# EAGLE design PixelRing (EAGLE 8.4.0)

## Sheet 1 of 2
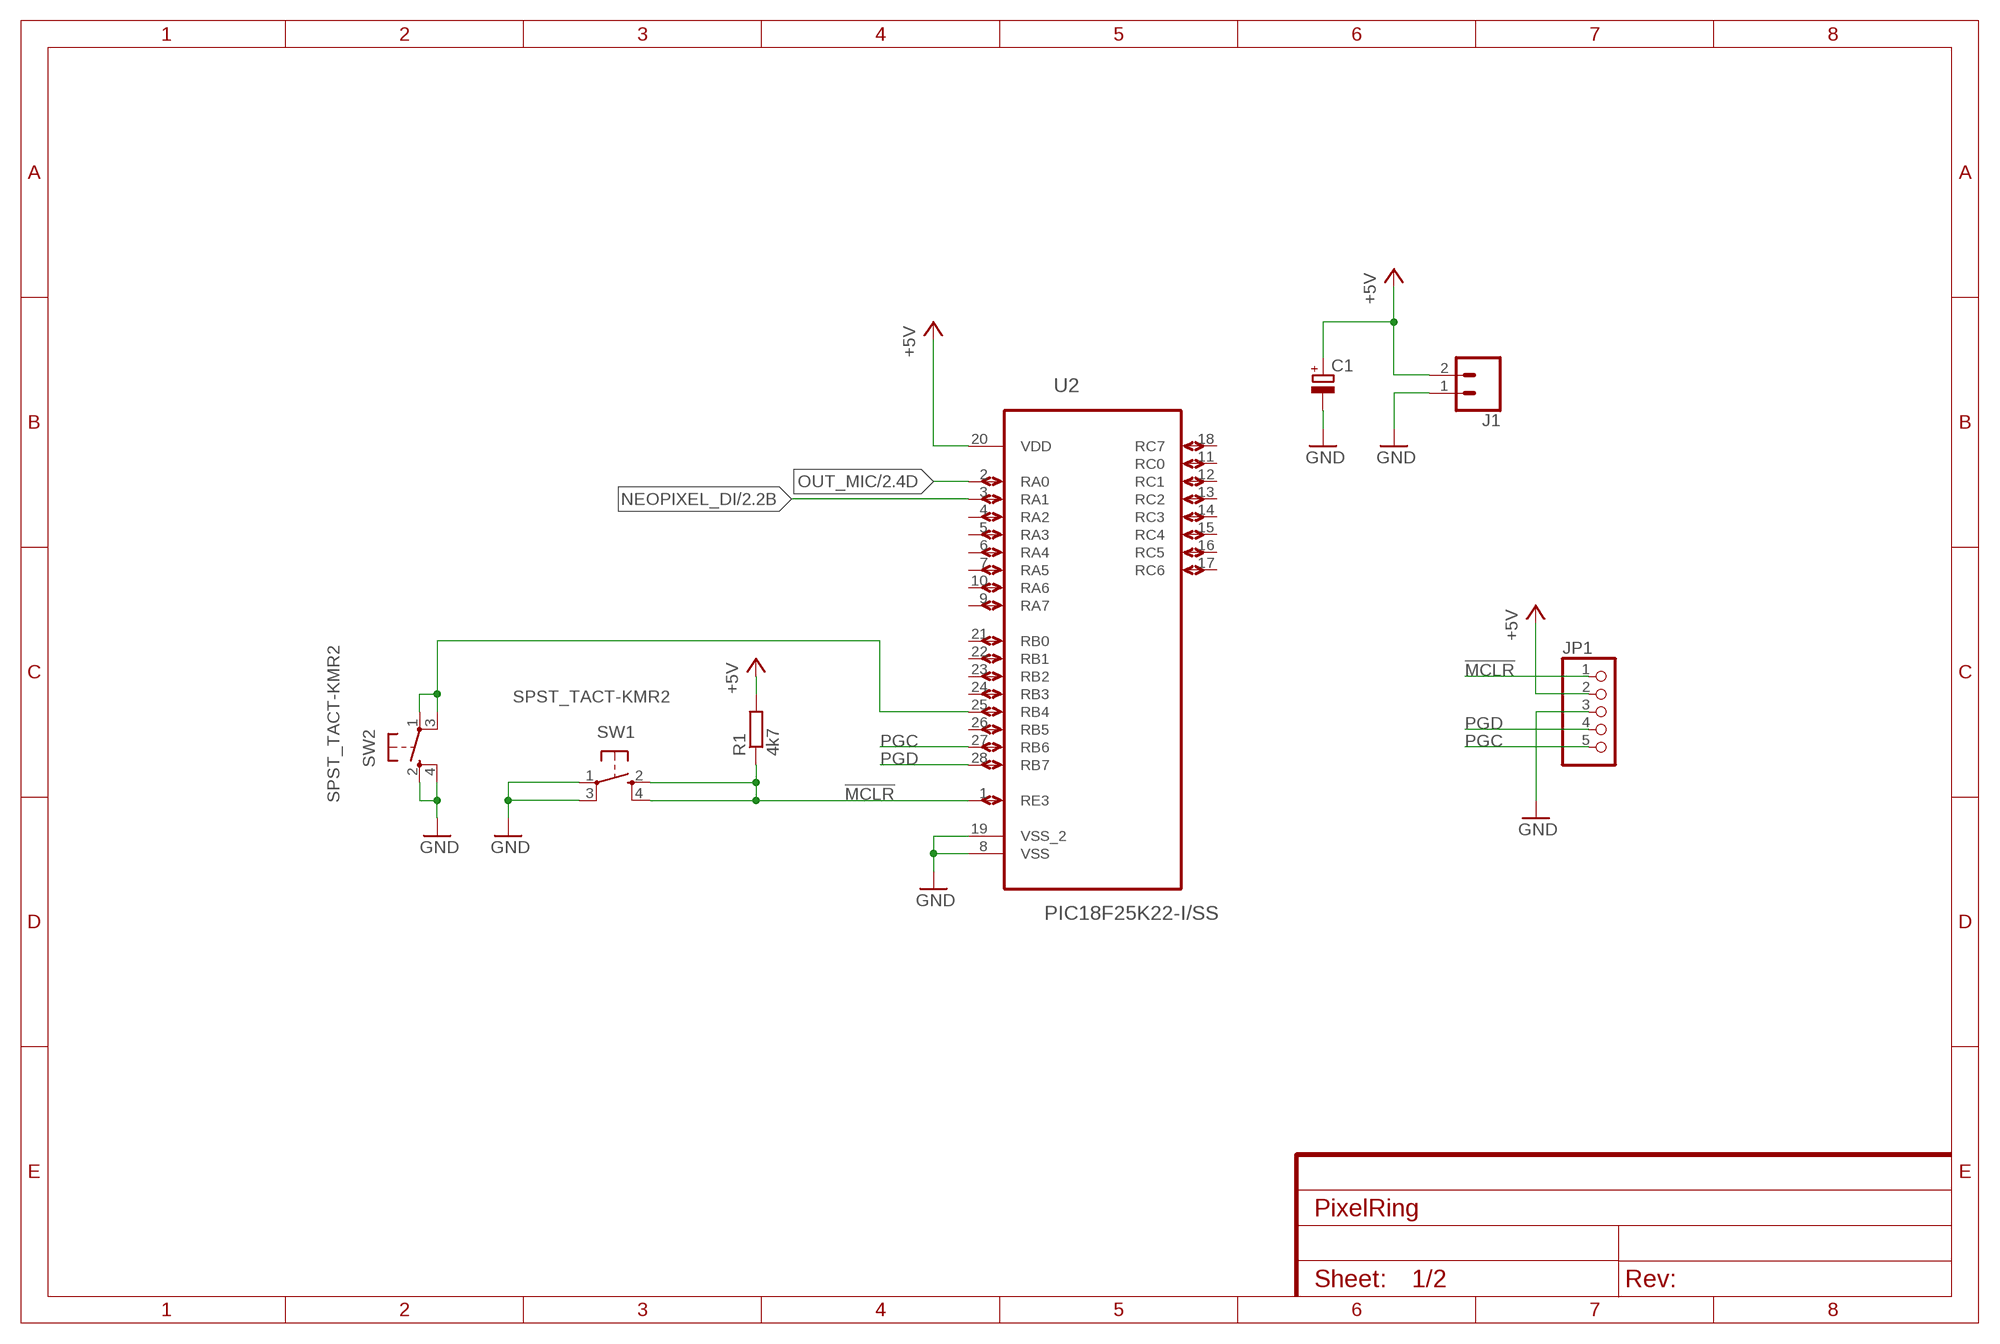
[diagram p0: schematic, sheet 1]

### Parts
C1  CPOL-EUSMCB  [SMC_B]
J1  CONN_02-JST-2MM-SMT  [JST-2-SMD]
JP1  PINHD-1X5  [1X05]
R1  4k7  R-EU_R0603  [R0603]
SW1  SPST_TACT-KMR2  [KMR2]
SW2  SPST_TACT-KMR2  [KMR2]
U2  PIC18F25K22-I/SS  [SOP65P780X200-28N]

### Nets
!MCLR: JP1.1 R1.1 SW1.2(S) SW1.4(S1) U2.1(RE3)
+5V: C1.+ J1.2 JP1.2 R1.2 U2.20(VDD) ; also sheet 2
GND: C1.- J1.1 JP1.3 SW1.1(P) SW1.3(P1) SW2.2(S) SW2.4(S1) U2.8(VSS) U2.19(VSS_2) ; also sheet 2
N$19: SW2.1(P) SW2.3(P1) U2.25(RB4)
NEOPIXEL_DI: U2.3(RA1) ; also sheet 2
OUT_MIC: U2.2(RA0) ; also sheet 2
PGC: JP1.5 U2.27(RB6)
PGD: JP1.4 U2.28(RB7)
Unconnected: U2.4(RA2) U2.5(RA3) U2.6(RA4) U2.7(RA5) U2.9(RA7) U2.10(RA6) U2.11(RC0) U2.12(RC1) U2.13(RC2) U2.14(RC3) U2.15(RC4) U2.16(RC5) U2.17(RC6) U2.18(RC7) U2.21(RB0) U2.22(RB1) U2.23(RB2) U2.24(RB3) U2.26(RB5)

## Sheet 2 of 2
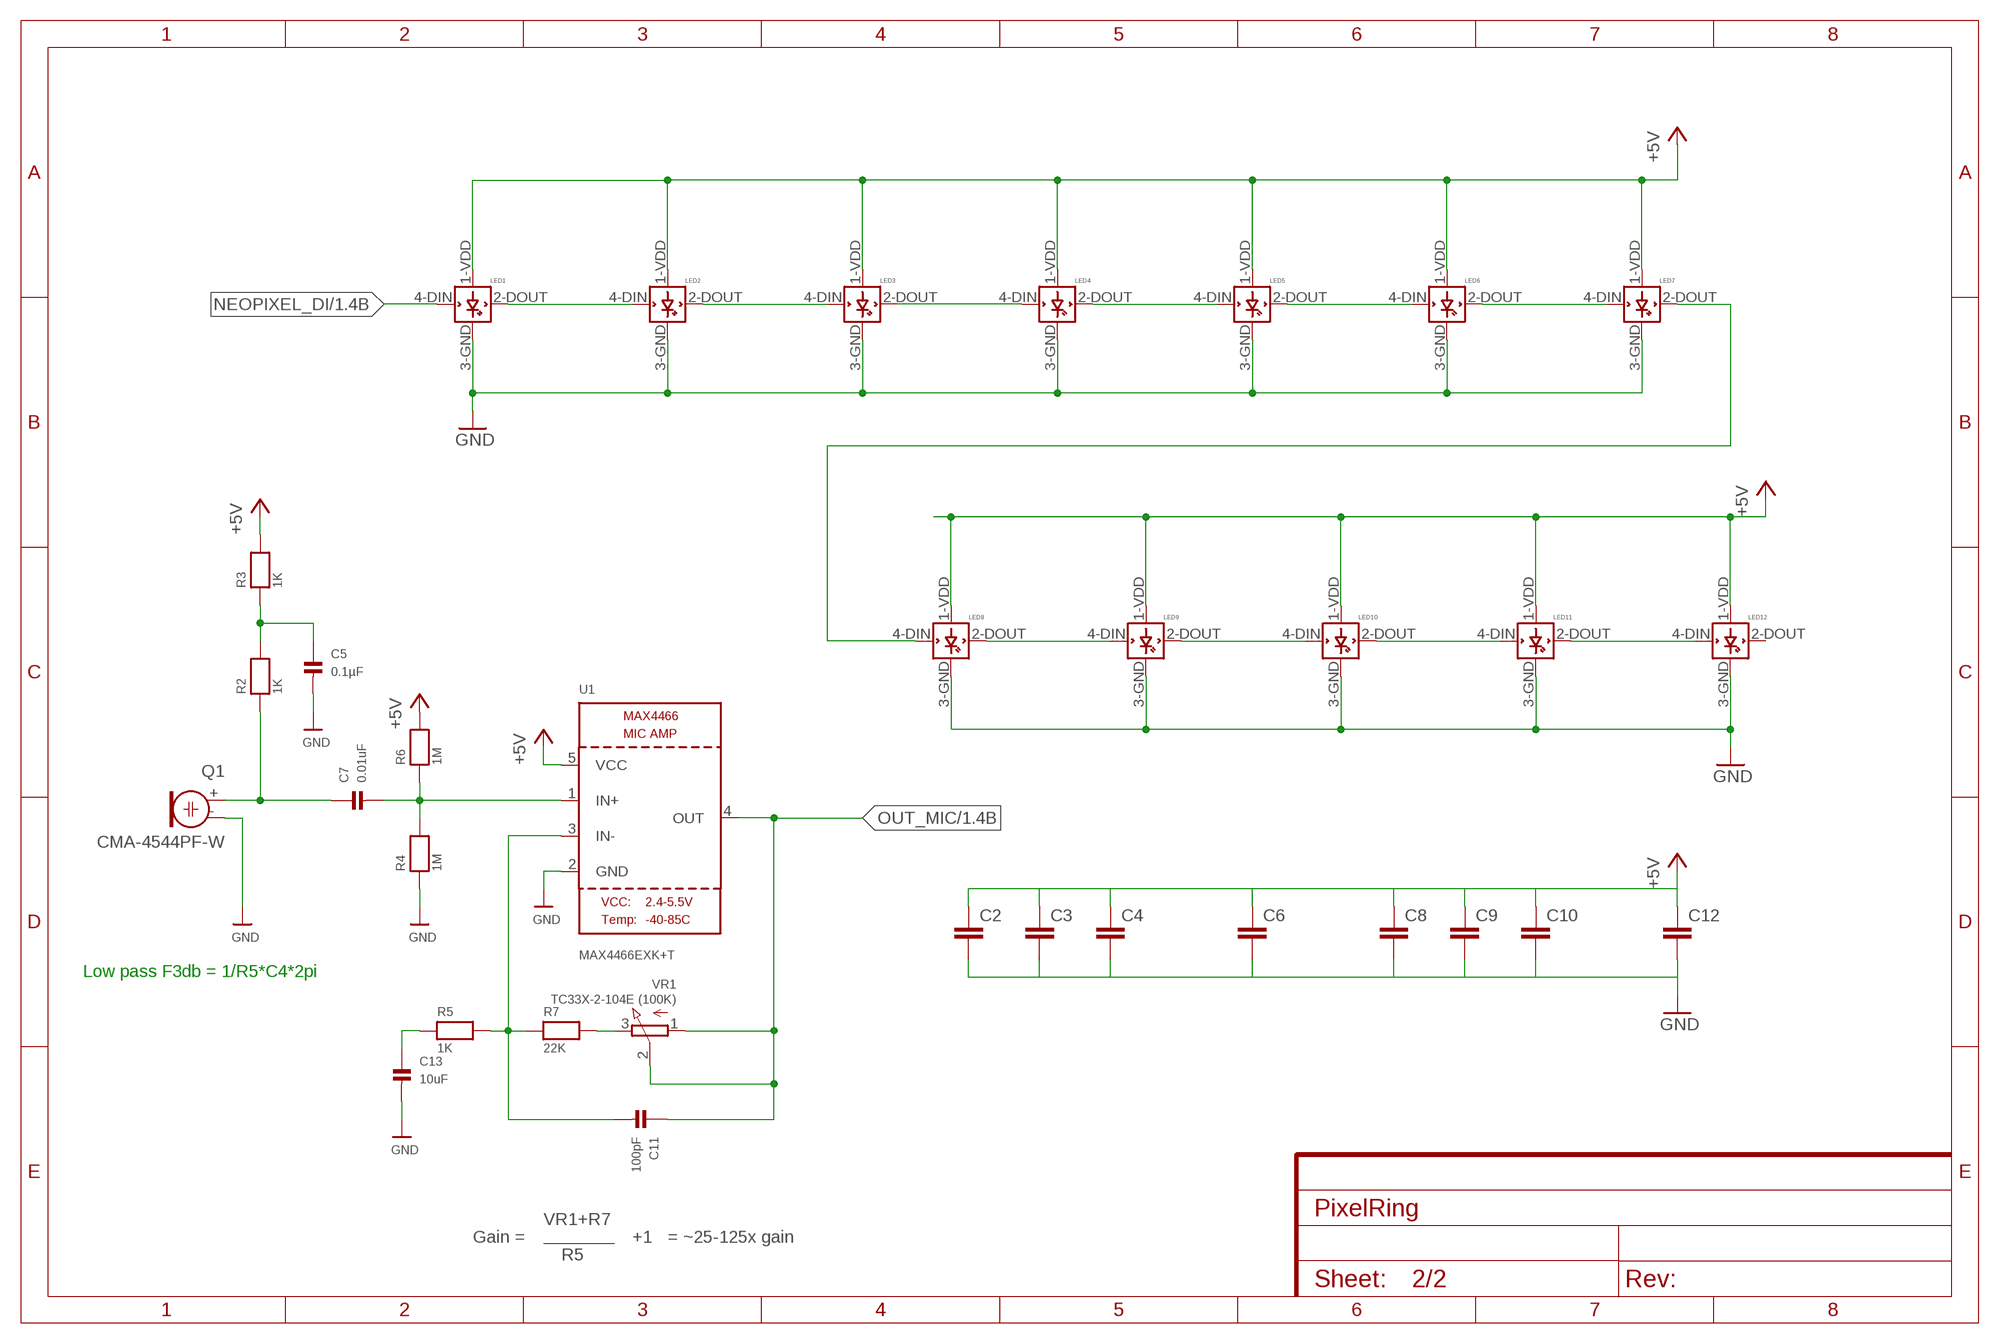
[diagram p1: schematic, sheet 2]

### Parts
C2  C-EUC0603  [C0603]
C3  C-EUC0603  [C0603]
C4  C-EUC0603  [C0603]
C5  0.1µF  CAP_CERAMIC0805  [0805]
C6  C-EUC0603  [C0603]
C7  0.01uF  CAP_CERAMIC0805  [0805]
C8  C-EUC0603  [C0603]
C9  C-EUC0603  [C0603]
C10  C-EUC0603  [C0603]
C11  100pF  CAP_CERAMIC0805  [0805]
C12  C-EUC0603  [C0603]
C13  10uF  CAP_CERAMIC0805  [0805]
LED1  WS2812B  [WS2812B]
LED2  WS2812B  [WS2812B]
LED3  WS2812B  [WS2812B]
LED4  WS2812B  [WS2812B]
LED5  WS2812B  [WS2812B]
LED6  WS2812B  [WS2812B]
LED7  WS2812B  [WS2812B]
LED8  WS2812B  [WS2812B]
LED9  WS2812B  [WS2812B]
LED10  WS2812B  [WS2812B]
LED11  WS2812B  [WS2812B]
LED12  WS2812B  [WS2812B]
Q1  CMA-4544PF-W  ELECTRET  [ELECTRET_9.7]
R2  1K  RESISTOR0805  [0805]
R3  1K  RESISTOR0805  [0805]
R4  1M  RESISTOR0805  [0805]
R5  1K  RESISTOR0805  [0805]
R6  1M  RESISTOR0805  [0805]
R7  22K  RESISTOR0805  [0805]
U1  MAX4466EXK+T  MAX4466""  [SC70-5]
VR1  TC33X-2-104E (100K)  TRIMPOTTC33X-2  [TRIMPOT_BOURNS_TC33X-2]

### Nets
+5V: C2.1 C3.1 C4.1 C6.1 C8.1 C9.1 C10.1 C12.1 LED1.1-VDD(VDD) LED2.1-VDD(VDD) LED3.1-VDD(VDD) LED4.1-VDD(VDD) LED5.1-VDD(VDD) LED6.1-VDD(VDD) LED7.1-VDD(VDD) LED8.1-VDD(VDD) LED9.1-VDD(VDD) LED10.1-VDD(VDD) LED11.1-VDD(VDD) LED12.1-VDD(VDD) R3.2 R6.2 U1.5(VCC) ; also sheet 1
GND: C2.2 C3.2 C4.2 C5.2 C6.2 C8.2 C9.2 C10.2 C12.2 C13.2 LED1.3-GND(GND) LED2.3-GND(GND) LED3.3-GND(GND) LED4.3-GND(GND) LED5.3-GND(GND) LED6.3-GND(GND) LED7.3-GND(GND) LED8.3-GND(GND) LED9.3-GND(GND) LED10.3-GND(GND) LED11.3-GND(GND) LED12.3-GND(GND) Q1.- R4.1 U1.2(GND) ; also sheet 1
N$1: LED1.2-DOUT(DOUT) LED2.4-DIN(DIN)
N$2: LED2.2-DOUT(DOUT) LED3.4-DIN(DIN)
N$3: LED3.2-DOUT(DOUT) LED4.4-DIN(DIN)
N$4: LED4.2-DOUT(DOUT) LED5.4-DIN(DIN)
N$5: LED5.2-DOUT(DOUT) LED6.4-DIN(DIN)
N$6: LED6.2-DOUT(DOUT) LED7.4-DIN(DIN)
N$7: LED7.2-DOUT(DOUT) LED8.4-DIN(DIN)
N$8: LED8.2-DOUT(DOUT) LED9.4-DIN(DIN)
N$9: LED9.2-DOUT(DOUT) LED10.4-DIN(DIN)
N$10: LED10.2-DOUT(DOUT) LED11.4-DIN(DIN)
N$11: LED11.2-DOUT(DOUT) LED12.4-DIN(DIN)
N$12: C7.1 Q1.+ R2.1
N$13: C5.1 R2.2 R3.1
N$14: C7.2 R4.2 R6.1 U1.1(IN+)
N$16: C11.2 R5.2 R7.1 U1.3(IN-)
N$17: C13.1 R5.1
N$18: R7.2 VR1.3(E)
NEOPIXEL_DI: LED1.4-DIN(DIN) ; also sheet 1
OUT_MIC: C11.1 U1.4(OUT) VR1.1(A) VR1.2(S) ; also sheet 1
Unconnected: LED12.2-DOUT(DOUT)

### Notes on the sheet
- Low pass F3db = 1/R5*C4*2pi
- VR1+R7
- Gain = | +1 | = ~25-125x gain
- R5

## Library data of the parts
C1 = rcl:CPOL-EU: POLARIZED CAPACITOR, European symbol
C2-C4 C6 C8-C10 C12 = rcl:C-EU: CAPACITOR, European symbol
C5 C7 C11 C13 = microbuilder:CAP_CERAMIC: Ceramic Capacitors 0402 - 0402 Surface Mount Capacitors 16pF 50V 5% [Digikey: 445-4899-2-ND] 18pF 50V 5% [Digikey: 490-1281-2-ND] 22pF 50V 5% [Digikey: 490-1283-2-ND] 68pF 50V 5% [Digikey: 490-1289-2-ND] 0.1uF 10V 10% [Digikey: 490-1318-2-ND] 1.0uF 6.3V 10% [Digikey: 490-1320-2-ND] 0603 - 0603 Surface Mount Capacitors 16 pF 50V 5% [Digikey: 445-5051-2-ND] 22 pF 50V [Digikey: PCC220ACVTR-ND] 33 pF 50V 5% [Digikey: 490-1415-1-ND] 56pF 50V 5% [Digikey: 490-1421-1-ND] 220pF 50V 5% [Digikey: 445-1285-1-ND] 680 pF 50V 2200 pF 50V 5% C0G [Digikey: 445-1297-1-ND] 5600 pF 100V 5% X7R [Digikey: 478-3711-1-ND] 0.1 µF 25V 10% [Digikey: PCC2277TR-ND] 0.22 µF 16V 10% X7R [Digikey: 445-1318-1-ND] 1.0 µF 25V 10% [Digikey: 445-5146-2-ND] 0603 - RF Specific 3pF 250V +/-0.1pF RF [Digikey: 712-1347-1-ND] 18 pF 250V 5% [Digikey: 478-3505-1-ND or 712-1322-1-ND] 56 pF 250V 5% C0G RF [Digikey: 490-4867-1-ND] 68 pF 250V RF [Digikey: 490-4868-1-ND] 0805 - 0805 Surface Mount Capacitors 220 pF 250V 2% RF Ceramic Capacitor [Digikey: 712-1398-1-ND] 1000 pF 50V 2% NP0 Ceramic Capacitor [Digikey: 478-3760-1-ND] 0.1 µF 25V 10% Ceramic Capacitor [Digikey: PCC1828TR-ND] 1.0 µF 16V 10% Ceramic Capacitor[Digikey: 490-1691-2-ND] 10.0 µF 10V 10% Ceramic Capacitor[Digikey: 709-1228-1-ND] 10.0 uF 16V 10% Ceramic Capacitor [Digikey: 478-5165-2-ND] 47 uF 6.3V 20% Ceramic Capacitor [Digikey: 587-1779-1-ND or 399-5506-1-ND] 1206 - 1206 Surface Mount Capacitors 47uF 10V 20% Ceramic Capacitor [Digikey: 490-5528-1-ND or 399-5508-1-ND or 445-6010-1-ND] 100uF 6.3V -20%, +80% Y5V Ceramic Capacitor (Digikey: 490-4512-1-ND, Mouser: 81-GRM31CF50J107ZE1L)
J1 = SparkFun-Connectors:CONN_02: Multi connection point. Often used as Generic Header-pin footprint for 0.1 inch spaced/style header connections On any of the 0.1 inch spaced packages, you can populate with these: Break Away Headers - Straight <https://www.sparkfun.com/products/116> (PRT-00116) Break Away Male Headers - Right Angle <https://www.sparkfun.com/products/553> (PRT-00553) Female Headers <https://www.sparkfun.com/products/115> (PRT-00115) Break Away Headers - Machine Pin <https://www.sparkfun.com/products/117> (PRT-00117) Break Away Female Headers - Swiss Machine Pin <https://www.sparkfun.com/products/743> (PRT-00743) For SCREWTERMINALS and SPRING TERMINALS visit here: Screw Terimnals on SparkFun.com <https://www.sparkfun.com/search/results?term=Screw+Terminals> (5mm/3.5mm/2.54mm spacing) This device is also useful as a general connection point to wire up your design to another part of your project. Our various solder wires solder well into these plated through hole pads. Hook-Up Wire - Assortment (Stranded, 22 AWG) <https://www.sparkfun.com/products/11375> (PRT-11375) Hook-Up Wire - Assortment (Solid Core, 22 AWG) <https://www.sparkfun.com/products/11367> (PRT-11367) View the entire wire category on our website here <https://www.sparkfun.com/categories/141> Special notes: Molex polarized connector foot print use with: PRT-08233 with associated crimp pins and housings. 2.54_SCREWTERM for use with PRT-10571. 3.5mm Screw Terminal footprints for PRT-08084 5mm Screw Terminal footprints for use with PRT-08432; PROD_ID: CONN-11443
JP1 = pinhead:PINHD-1X5: PIN HEADER
LED1-LED12 = adafruit:WS2812B
Q1 = microbuilder:ELECTRET: Electret microphone Thru hole 2.54mm spacing with 9.7mm diameter
R1 = rcl:R-EU_: RESISTOR, European symbol
R2-R7 = microbuilder:RESISTOR: Resistors 0402 - 0402 Surface Mount Package 22 Ohm 1% 1/16W [Digikey: 311-22.0LRTR-ND] 33 Ohm 5% 1/16W 1.0K 5% 1/16W 1.5K 5% 1/16W 2.0K 1% 1/16W 10.0K 1% 1/16W [Digikey: 311-10.0KLRTR-ND] 10.0K 5% 1/16W [Digikey: RMCF0402JT10K0TR-ND] 12.1K 1% 1/16W [Digikey: 311-22.0LRTR-ND] 100.0K 5% 1/16W 0603 - 0603 Surface Mount Package 0 Ohm 1/10 Watt 1% Resistor 15 Ohm 1/10 Watt 1% Resistor 33 Ohm 1/10 Watt 1% Resistor 49.9 Ohm 1/10 Watt 1% Resistor 100 Ohm 1/10 Watt 1% Resistor 150 Ohm 1/10 Watt 1% Resistor 240 Ohm 1/10 Watt 1% Resistor 390 Ohm 1/10 Watt 1% Resistor 560 Ohm 1/10 Watt 1% Resistor 680 Ohm 1/10 Watt 1% Resistor 750 Ohm 1/10 Watt 1% Resistor 1.0K Ohm 1/10 Watt 1% Resistor 1.5K Ohm 1/10 Watt 1% Resistor 2.0K Ohm 1/10 Watt 1% Resistor 2.2K Ohm 1/10 Watt 1% Resistor 3.3K Ohm 1/10 Watt 1% Resistor 4.7K Ohm 1/10 Watt 1% Resistor 10.0K Ohm 1/10 Watt 1% Resistor 12.0K Ohm 1/10 Watt 1% Resistor 12.1K Ohm 1/10 Watt 1% Resistor 20.0K Ohm 1/10 Watt 1% Resistor 33.0K Ohm 1/10 Watt 1% Resistor 100.0K Ohm 1/10 Watt 1% Resistor 0805 - 0805 Surface Mount Package 0 Ohm 1/8 Watt 1% Resistor 33 Ohm 1/8 Watt 1% Resistor 100 Ohm 1/8 Watt 1% Resistor 150 Ohm 1/8 Watt 1% Resistor 200 Ohm 1/8 Watt 1% Resistor 240 Ohm 1/8 Watt 1% Resistor 330 Ohm 1/8 Watt 1% Resistor 390 Ohm 1/8 Watt 1% Resistor 470 Ohm 1/8 Watt 1% Resistor 1.0K Ohm 1/8 Watt 1% Resistor 1.5K Ohm 1/8 Watt 1% Resistor 2.0K Ohm 1/8 Watt 1% Resistor 4.7K Ohm 1/8 Watt 1% Resistor 5.1K Ohm 1/8 Watt 1% Resistor 5.6K Ohm 1/8 Watt 1% Resistor 10.0K Ohm 1/8 Watt 1% Resistor 22.0K Ohm 1/8 Watt 1% Resistor 33.0K Ohm 1/8 Watt 1% Resistor 100K Ohm 1/8 Watt 1% Resistor 1206 - 1206 Surface Mount Package 2012 - 2010 Surface Mount Package 0.11 Ohm 1/2 Watt 1% Resistor - Digikey: RHM.11UCT-ND
SW1 SW2 = adafruit:SPST_TACT: SMT 6mm switch, EVQQ2 series http://www.ladyada.net/library/eagle
U1 = microbuilder:MAX4466: MAX4466 - Microphone Pre-Amp
U2 = 0_Lib_IRSEEM:PIC18F25K22-I/SS: MCU 8BIT 32KB FLASH 5.5V,SSOP-28; MPN: PIC18F25K22-I/SS; OC_FARNELL: 1821936; OC_NEWARK: 63R7821; PACKAGE: SSOP-28; SUPPLIER: Microchip
VR1 = microbuilder:TRIMPOT: 3-Pin SMT Trimpots Bourns TC33 (X-2) Series 10K - Digikey: TC33X-2-103E 100K - Digikey: TC33X-104ECT-ND Bourns 3303 (W) Series 3mm 10K Single Turn - Digikey: 3303W-103ETR-ND 3mm 100K Single Turn - Digikey: 3303X-104ETR-ND

## Board
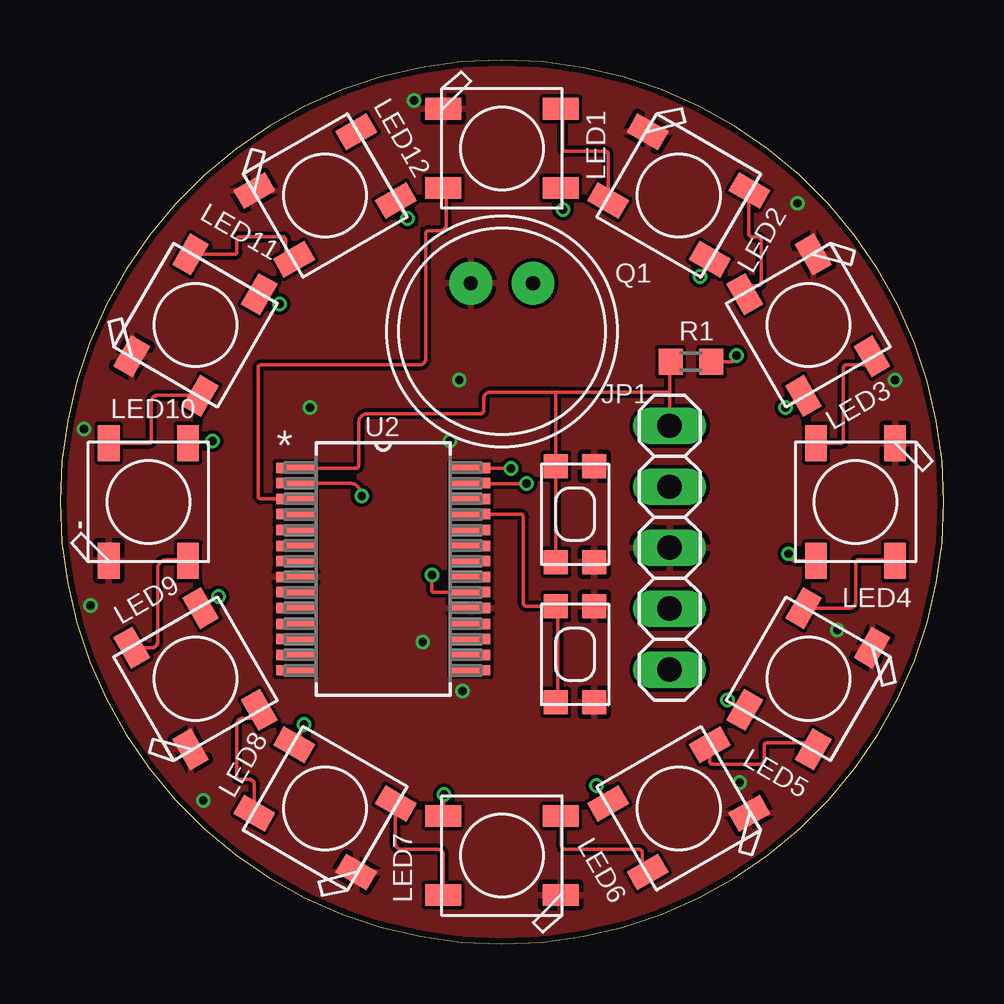
[diagram p2: board, top side]
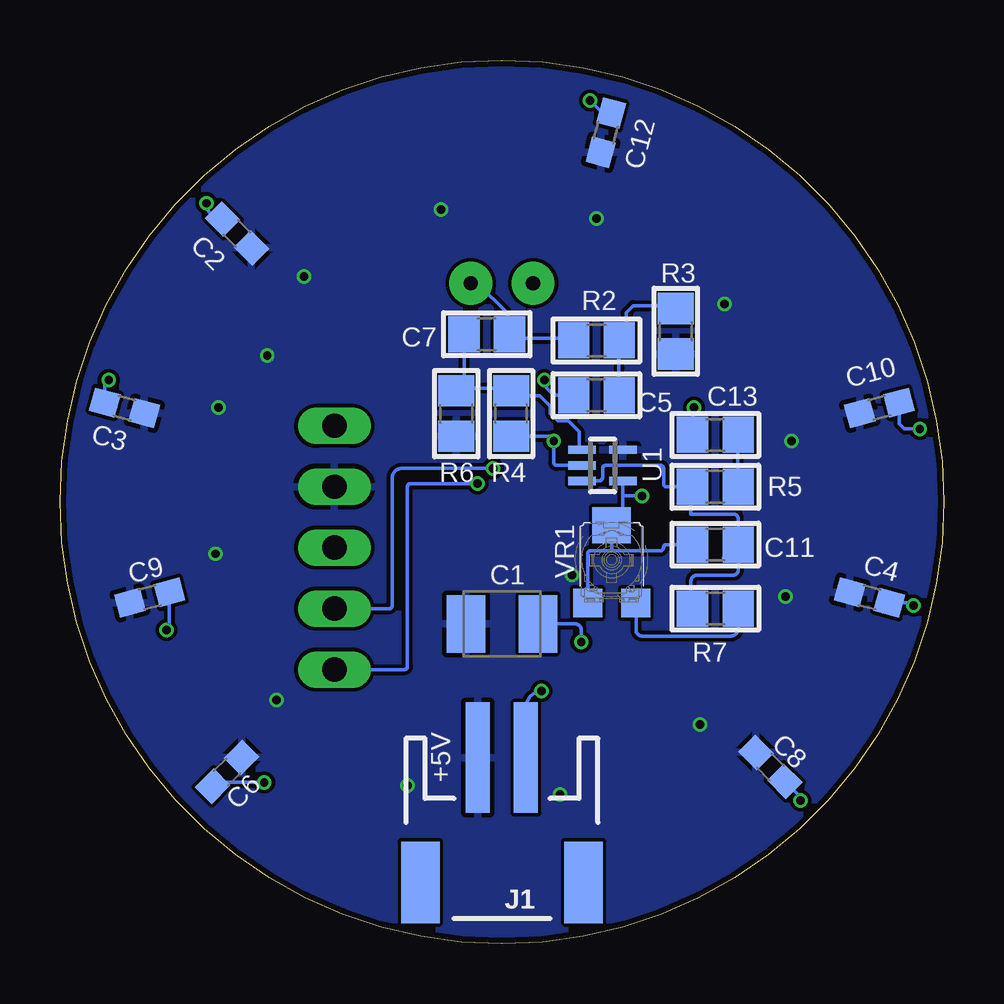
[diagram p3: board, bottom side, seen from below]

Size 36.83 x 36.83 mm. Coordinates in mm from the lower left corner, seen from the top.
Outline: 0,18.41 arc90 18.41,0 arc90 36.83,18.41 arc90 18.41,36.83 arc90 0,18.41
Copper layers (1*16): Top 0.018mm / dielectric 1.55mm / Bottom 0.018mm
Design rules "eC_2Layer_PClass6_BaseCopperO18_eCDefault": minimum track width 0.15mm, minimum drill 0.35mm, track to track 0.15mm, track to pad 0.15mm, pad to pad 0.15mm, via to via 0.15mm, smd to smd 0mil, copper to edge 0.25mm, drill to drill 0.35mm, minimum pad ring 0.175mm, minimum via ring 0.125mm, stop-mask expansion 0mil, vias tented up to drill 0.45mm, thermal gap 0.2mm

### Footprints (pad centres in the part's own frame; a part is rotated, then mirrored left to right if it is on the bottom)
SMC_B = smd 1.6 x 2.4: + -1.5,0; - 1.5,0
C0603 = smd 1.1 x 1: 1 -0.85,0; 2 0.85,0
0805 = smd 1.3 x 1.5: 1 -0.95,0; 2 0.95,0
JST-2-SMD = smd 1 x 4.6: 1 -1,-3.7; 2 1,-3.7 | smd 1.6 x 3.4: NC1 -3.4,1.5; NC2 3.4,1.5
1X05 = drill 1.016 long: 1 -5.08,0; 2 -2.54,0; 3 0,0; 4 2.54,0; 5 5.08,0
WS2812B = smd 1.5 x 0.9: 1-VDD 2.45,-1.65; 2-DOUT 2.45,1.65; 3-GND -2.45,1.65; 4-DIN -2.45,-1.65
ELECTRET_9.7 = drill 0.6 pad 1.778: + 1.3,2; - -1.3,2
R0603 = smd 1 x 1.1: 1 -0.85,0; 2 0.85,0
KMR2 = smd 1 x 1: 1 2,0.8; 2 2,-0.8; 3 -2,0.8; 4 -2,-0.8
SC70-5 = smd 0.35 x 1.15: 1 -0.65,-0.85; 2 0,-0.85; 3 0.65,-0.85; 4 0.65,0.85; 5 -0.65,0.85
SOP65P780X200-28N = smd 1.651 x 0.432: 1 -3.632,4.216; 2 -3.632,3.581; 3 -3.632,2.921; 4 -3.632,2.286; 5 -3.632,1.626; 6 -3.632,0.965; 7 -3.632,0.33; 8 -3.632,-0.33; 9 -3.632,-0.965; 10 -3.632,-1.626; 11 -3.632,-2.286; 12 -3.632,-2.921; 13 -3.632,-3.581; 14 -3.632,-4.216; 15 3.632,-4.216; 16 3.632,-3.581; 17 3.632,-2.921; 18 3.632,-2.286; 19 3.632,-1.626; 20 3.632,-0.965; 21 3.632,-0.33; 22 3.632,0.33; 23 3.632,0.965; 24 3.632,1.626; 25 3.632,2.286; 26 3.632,2.921; 27 3.632,3.581; 28 3.632,4.216
TRIMPOT_BOURNS_TC33X-2 = smd 1.2 x 1.2: 1 -1,-1.8; 3 1,-1.8 | smd 1.6 x 1.5: 2 0,1.45

### Placement (x,y rotation side)
C1  18.41,13.34 0 bottom
C2  29.45,29.6 135 bottom
C3  34.14,22.34 165 bottom
C4  3.1,14.43 345 bottom
C5  14.48,22.86 180 bottom
C6  29.87,7.17 225 bottom
C7  19.05,25.4 180 bottom
C8  7.23,7.38 315 bottom
C9  33.09,14.43 15 bottom
C10  2.69,22.34 15 bottom
C11  9.53,16.64 0 bottom
C12  14.08,33.8 75 bottom
C13  9.53,21.21 180 bottom
J1  18.41,4.06 180 bottom
JP1  25.4,16.51 270 top
LED1  18.41,33.15 0 top
LED2  25.78,31.18 330 top
LED3  31.18,25.78 300 top
LED4  33.15,18.41 270 top
LED5  31.18,11.05 240 top
LED6  25.78,5.65 210 top
LED7  18.41,3.68 180 top
LED8  11.05,5.65 150 top
LED9  5.65,11.05 120 top
LED10  3.68,18.41 90 top
LED11  5.65,25.78 60 top
LED12  11.05,31.18 30 top
Q1  18.41,25.53 0 top
R1  26.29,24.26 0 top
R2  14.48,25.15 0 bottom
R3  11.18,25.53 270 bottom
R4  18.03,22.1 90 bottom
R5  9.53,19.05 180 bottom
R6  20.32,22.1 270 bottom
R7  9.53,13.97 0 bottom
SW1  21.46,17.91 270 top
SW2  21.46,12.07 90 top
U1  14.22,19.94 270 bottom
U2  13.46,15.62 0 top
VR1  13.84,16 0 bottom

### Tracks (layer width: path | path; a pad name or v marks a point on that pad's centre or on a via)
!MCLR
  Top 0.152: SW1.2 SW1.4 20.66,22.95 arc-90 20.7,22.99 | JP1.1 25.4,22.99 | 25.4,22.99 25.4,24.22 arc-90 R1.1 | 20.7,22.99 25.4,22.99 | 20.7,22.99 17.91,22.99 arc90 17.65,22.73 17.65,22.22 arc-90 17.53,22.1 12.83,22.1 arc90 12.45,21.72 12.45,19.94 arc-90 12.32,19.81 9.86,19.81 arc-90 U2.1
+5V  (via drill 0.35)
  Top 0.15: 15.79,6.19 15.95,6.04 v16,6.22
  Top 0.152: LED4.1-VDD 30.64,15.97 arc-90 v30.35,16.26 | LED5.1-VDD v27.81,10.16 | LED6.1-VDD v22.35,6.6 | LED7.1-VDD v16,6.22 | LED8.1-VDD 10.16,9.02 v10.16,9.14 | LED9.1-VDD v6.6,14.48 | LED10.1-VDD v6.35,20.95 | LED11.1-VDD v9.14,26.67 | LED12.1-VDD v14.48,30.23 | LED1.1-VDD v20.95,30.61 | LED2.1-VDD v26.67,27.81 | LED3.1-VDD v30.23,22.35 | R1.2 27.94,24.26 arc90 v28.19,24.51 | U2.20 15.57,14.66 arc-90 15.49,14.73 v15.49,15.37
  pour Bottom: -0.64,37.46 37.46,37.46 37.46,-0.64 -0.64,-0.64
GND  (via drill 0.35)
  Bottom 0.15: v14.74,35.14 14.29,34.7 14,34.7 C12.2
  Bottom 0.152: C13.2 10.48,22.29 arc90 v10.41,22.35 | C5.2 16,22.86 arc90 v16.64,23.49 | J1.1 17.41,9.76 arc90 v16.76,10.54 | C9.2 32.27,13.2 arc90 v32.38,13.08 | C6.2 arc90 30.31,6.73 v28.32,6.73 | C3.2 34.96,23.2 arc90 v34.8,23.49 | C2.2 30.07,30.2 arc90 v30.73,30.86 | U1.2 16.13,19.94 arc90 16.26,20.07 v16.26,20.95 arc-90 16.45,21.15 R4.1 | C10.2 1.87,21.68 1.65,21.46 v1.01,21.46 | C4.2 1.39,14.21 v1.27,14.1 | C8.2 5.97,6.11 v5.97,5.97 | C1.- 15.37,13.34 arc90 15.11,13.08 v15.11,12.57
  pour Top: -0.64,37.46 37.46,37.46 37.46,-0.64 -0.64,-0.64
N$1
  Top 0.15: 22.84,31.09 LED2.4-DIN
  Top 0.152: LED2.4-DIN 22.83,32.92 arc90 22.73,33.02 21.08,33.02 arc-90 20.95,33.15 20.95,34.71 arc90 LED1.2-DOUT
N$2
  Top 0.152: LED3.4-DIN arc-90 28.88,27.43 29.08,27.43 arc90 29.21,27.56 29.21,29.34 arc90 29.08,29.46 28.83,29.46 arc-90 28.7,29.59 28.7,31.36 arc-90 LED2.2-DOUT
N$3
  Top 0.15: 31.55,20.89 LED4.4-DIN | 33.8,24.34 LED3.2-DOUT
  Top 0.152: LED4.4-DIN 32.55,20.86 arc90 32.64,20.95 32.64,24 arc-90 32.77,24.13 33.58,24.13 arc90 33.8,24.34
N$4
  Top 0.15: 31.09,14 LED5.4-DIN | LED4.2-DOUT 34.7,15.95
  Top 0.152: LED5.4-DIN 32.92,14 arc90 33.15,14.22 33.15,15.88 arc-90 33.27,16 34.76,16 arc-90 LED4.2-DOUT
N$5
  Top 0.15: 27.34,8.29 27.2,8.29 LED6.4-DIN | LED5.2-DOUT 31.24,8
  Top 0.152: LED6.4-DIN 27.08,7.59 arc90 27.18,7.49 29.21,7.49 arc90 29.34,7.62 29.34,8.26 arc-90 29.46,8.38 31.11,8.38 arc-90 LED5.2-DOUT
N$6
  Top 0.15: 20.89,4.84 20.89,5.29 LED7.4-DIN | 24.34,3.04 LED6.2-DOUT
  Top 0.152: 20.89,4.84 20.89,4.12 arc90 21.08,3.94 24.13,3.94 arc-90 24.26,3.81 24.26,3.13 arc90 24.34,3.04
N$7
  Top 0.15: 15.95,2.14 LED7.2-DOUT | 14,5.75 LED8.4-DIN
  Top 0.152: 14,5.75 arc90 13.97,5.72 13.97,4.19 arc90 14.22,3.94 15.75,3.94 arc-90 15.97,3.72 LED7.2-DOUT
N$8
  Top 0.15: 8.29,9.2 8.29,9.4 8.29,9.65 LED9.4-DIN | 8.15,5.44 LED8.2-DOUT
  Top 0.152: LED8.2-DOUT 8.1,6.63 arc90 7.87,6.86 7.49,6.86 arc-90 7.37,6.99 7.37,9.14 arc-90 7.62,9.4 8.29,9.4
N$9
  Top 0.15: 3.04,12.5 LED9.2-DOUT | 5.29,15.95 LED10.4-DIN
  Top 0.152: LED9.2-DOUT 3.84,12.35 arc90 4.06,12.57 4.06,15.62 arc-90 4.44,16 5.24,16 arc-90 5.29,15.95
N$10
  Top 0.15: 2.14,20.89 LED10.2-DOUT | 5.75,22.84 LED11.4-DIN
  Top 0.152: 5.75,22.84 arc90 5.73,22.86 4.06,22.86 arc90 3.81,22.61 3.81,20.95 arc-90 3.72,20.86 LED10.2-DOUT
N$11
  Top 0.152: LED11.2-DOUT 6.48,28.73 6.5,28.73 7.26,28.73 arc90 7.37,28.83 7.37,29.34 arc-90 7.49,29.46 9.27,29.46 arc-90 9.4,29.34 9.4,28.88 arc90 LED12.4-DIN
N$12
  Bottom 0.15: R2.1 15.49,25.24 17.89,25.24 18.04,25.39 C7.1 18.2,25.54 18.2,26.29 19.39,27.49 19.7,27.49 Q1.+
N$13
  Bottom 0.15: C5.1 13.54,22.99 13.54,25.09 R2.2 13.4,25.24 13.25,25.39 13.25,26.29 12.95,26.59 11.29,26.59 R3.1
N$14
  Bottom 0.15: U1.1 15.2,20.59 15.2,21.34 15.65,21.79 16.09,21.79 16.39,22.09 16.39,22.39 16.84,22.84 17.74,22.84 17.89,22.99 R4.2 18.04,23.14 19.99,23.14 | 19.99,23.14 20.29,23.14 R6.1 19.99,23.14 | 19.99,23.14 C7.2
N$16
  Bottom 0.15: 8.6,17.29 8.6,16.7 C11.2 8.6,16.54 9.04,16.09 9.2,16.09 | 10.4,19.09 R5.2 10.54,19.09 10.58,19.13 10.7,19.24 | 10.4,14.6 10.41,14.48 R7.1 | 15.04,19.39 U1.3
  Bottom 0.152: 10.41,14.48 arc90 10.54,14.61 10.54,15.11 arc90 10.29,15.37 8.76,15.37 arc-90 8.58,15.56 C11.2 8.58,17.72 arc-90 8.76,17.91 10.54,17.91 10.54,18.98 arc90 R5.2 | 15.09,19.3 arc90 U1.3 14.37,19.29 arc-90 14.22,19.43 14.22,19.81 arc90 14.1,19.94 11.81,19.94 arc90 11.68,19.81 11.68,19.18 arc-90 11.56,19.05 10.67,19.05 arc-90 10.58,19.13
N$17
  Bottom 0.15: 8.58,19.17 R5.1 8.6,19.24 8.6,21.2 C13.1 8.58,21.12
N$18
  Bottom 0.152: R7.2 8.58,13.14 arc90 8.89,12.83 12.57,12.83 arc90 12.83,13.08 12.83,14.19 arc-90 VR1.3
N$19
  Top 0.15: SW2.3 20.74,10.1 20.74,14 SW2.1
  Top 0.152: SW2.1 19.46,14.07 arc-90 19.3,14.22 19.3,17.78 arc90 19.18,17.91 U2.25
NEOPIXEL_DI
  Top 0.15: 15.95,31.55 LED1.4-DIN 16.09,31.39 16.09,29.97 | 9.79,18.49 U2.3
  Top 0.152: U2.3 8.38,18.54 arc-90 8.26,18.67 8.26,24 arc-90 8.38,24.13 14.99,24.13 arc90 15.24,24.38 15.24,29.59 arc-90 15.37,29.72 15.84,29.72 arc90 16.09,29.97
OUT_MIC  (via drill 0.35)
  Top 0.152: U2.2 12.04,19.2 arc-90 v12.57,18.67
  Bottom 0.152: 13.37,18.67 U1.4 | 13.37,18.67 13.37,17.92 arc90 VR1.2 13.84,16.38 | VR1.1 14.84,16.27 arc90 14.73,16.38 13.84,16.38 | C11.1 11.56,16.64 arc-90 11.68,16.51 arc90 11.81,16.38 13.84,16.38 | v12.57,18.67 13.37,18.67
PGC  (via drill 0.35)
  Top 0.152: v19.43,19.18 17.12,19.18 arc-90 U2.27
  Bottom 0.152: JP1.5 22.48,11.43 arc-90 22.35,11.56 22.35,19.05 arc90 22.22,19.18 v19.43,19.18
PGD  (via drill 0.35)
  Top 0.152: v18.8,19.81 17.12,19.81 arc-90 U2.28
  Bottom 0.152: JP1.4 23.11,13.97 arc-90 22.99,14.1 22.99,19.43 arc90 22.61,19.81 v18.8,19.81

### Text on the board
tPlace: -
bPlace: +5V